# Altium schematic sheet schematic_GSM_02.SchDoc
size A; SheetNumber: 2
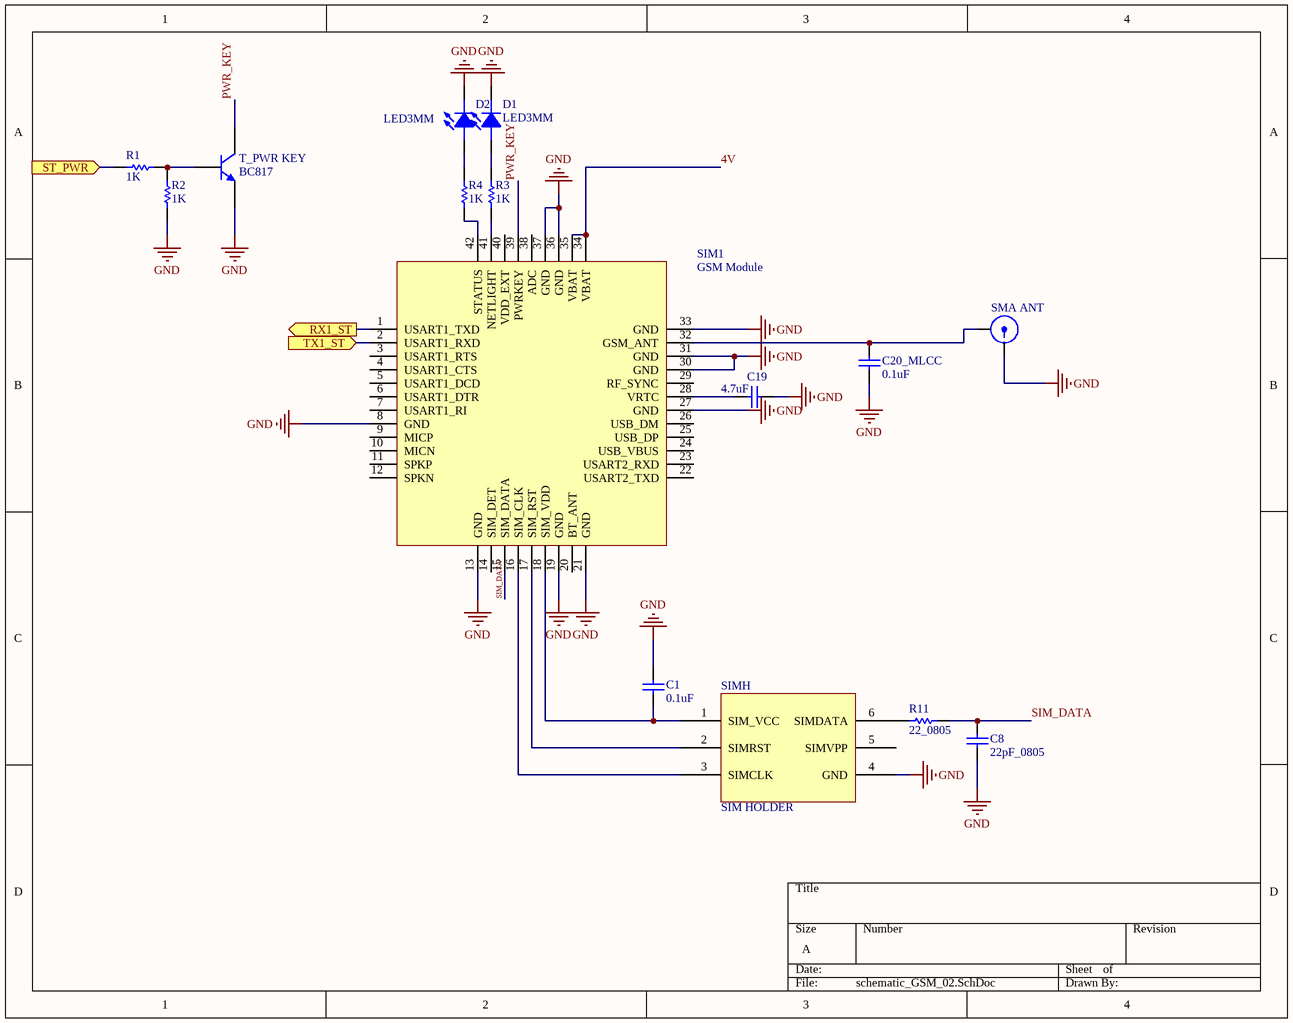
[diagram p0: schematic_GSM_02.SchDoc]

## Parts
C1  0.1uF  [CAPC3413X12N]
C8  22pF_0805  [CAPC3413X12N]
C19  4.7uF  [CAPC3413X12N]
C20_MLCC  0.1uF  [CAPC3413X12N]
D1  LED3MM  [LED3mm_GRN]
D2  LED3MM  [LED3mm_GRN]
R1  1K  [RESC4817X04N]
R2  1K  [RESC4817X04N]
R3  1K  [RESC3413X04N]
R4  1K  [RESC3413X04N]
R11  22_0805  [RESC3413X04N]
SIM1  GSM Module  [SIM800C]
SIMH  SIM HOLDER  [SIM HOLDER 6]
SMA_ANT  Antenna  [SMA]  (value not drawn)
T_PWR_KEY  BC817  [SOT23_N]

## Ports
RX1_ST (out), ST_PWR (in), TX1_ST (in)

## Nets
GND: C1.2 C8.1 C19.2 C20_MLCC.1 D1.2(CATHODE) D2.2(CATHODE) R2.2 SIM1.8(GND) SIM1.13(GND) SIM1.19(GND) SIM1.21(GND) SIM1.27(GND) SIM1.30(GND) SIM1.31(GND) SIM1.33(GND) SIM1.36(GND) SIM1.37(GND) SIMH.4(GND) SMA_ANT.1 T_PWR_KEY.2(E)
4V: SIM1.34(VBAT) SIM1.35(VBAT)
PWR_KEY: SIM1.39(PWRKEY) T_PWR_KEY.3(C)
RX1_ST: SIM1.1(USART1_TXD) ; port RX1_ST
SIM_DATA: C8.2 R11.2 SIM1.15(SIM_DATA)
ST_PWR: R1.2 ; port ST_PWR
TX1_ST: SIM1.2(USART1_RXD) ; port TX1_ST
NetC1_1: C1.1 SIM1.18(SIM_VDD) SIMH.1(SIM_VCC)
NetC19_1: C19.1 SIM1.28(VRTC)
NetC20_MLCC_2: C20_MLCC.2 SIM1.32(GSM_ANT) SMA_ANT.2
NetD1_1: D1.1(ANODE) R3.1
NetD2_1: D2.1(ANODE) R4.1
NetR1_1: R1.1 R2.1 T_PWR_KEY.1(B)
NetR3_2: R3.2 SIM1.41(NETLIGHT)
NetR4_2: R4.2 SIM1.42(STATUS)
NetR11_1: R11.1 SIMH.6(SIMDATA)
NetSIM1_16: SIM1.16(SIM_CLK) SIMH.3(SIMCLK)
NetSIM1_17: SIM1.17(SIM_RST) SIMH.2(SIMRST)

Not connected (* = marked no-connect by the designer): SIM1 3(USART1_RTS) 4(USART1_CTS) 5(USART1_DCD) 6(USART1_DTR) 7(USART1_RI) 9(MICP) 10(MICN) 11(SPKP) 12(SPKN) 14(SIM_DET) 20(BT_ANT) 22(USART2_TXD) 23(USART2_RXD) 24(USB_VBUS) 25(USB_DP) 26(USB_DM) 29(RF_SYNC) 38(ADC) 40(VDD_EXT); SIMH 5(SIMVPP)

## Library data of the parts
C1 C8 C19 C20_MLCC = CAP SMD 0805: CAP 0805; Designer: Abbas Basereh; Desc.: CAP SMD 0805; Data: 16-12-2016
D1 D2 = LED 3MM: Light Emitting Diode; Designer: Ali Hafizi
R1 R2 = RES 1206 0.25W: RES 1206; Designer: Abbas Basereh; Desc.: RES SMD 1206; Data: 16-12-2016
R3 R4 R11 = RES 0805 0.125W: RES 0805; Designer: Abbas Basereh; Desc.: RES SMD 0805; Data: 16-12-2016
SIM1 = SIM800C: Designer: Ali Hafizi
SIMH = SIM HOLDER: Deigner: Ali Hafizi
SMA_ANT = ANT SMA: Designer: Ali Hafizi
T_PWR_KEY = BC817: 45 V, 500 mA NPN general-purpose transistors; Published: 2017-2-8; LatestRevisionDate: 2017; LatestRevisionNote: IPC-7351 Footprint Added.; DatasheetVersion: 2017; PackageVersion: 2017-2-8; PackageReference: SOT23; Publisher: Abbas Basereh; PackageDescription: 3-Pin SOT-23 Package 0.95 mm Pitch, 2.3 mm Lead Span; ComponentLink1Description: Manufacturer Link; ComponentLink1URL: http://www.nxp.com/; ComponentLink2Description: Datasheet; ComponentLink2URL: http://www.nxp.com/